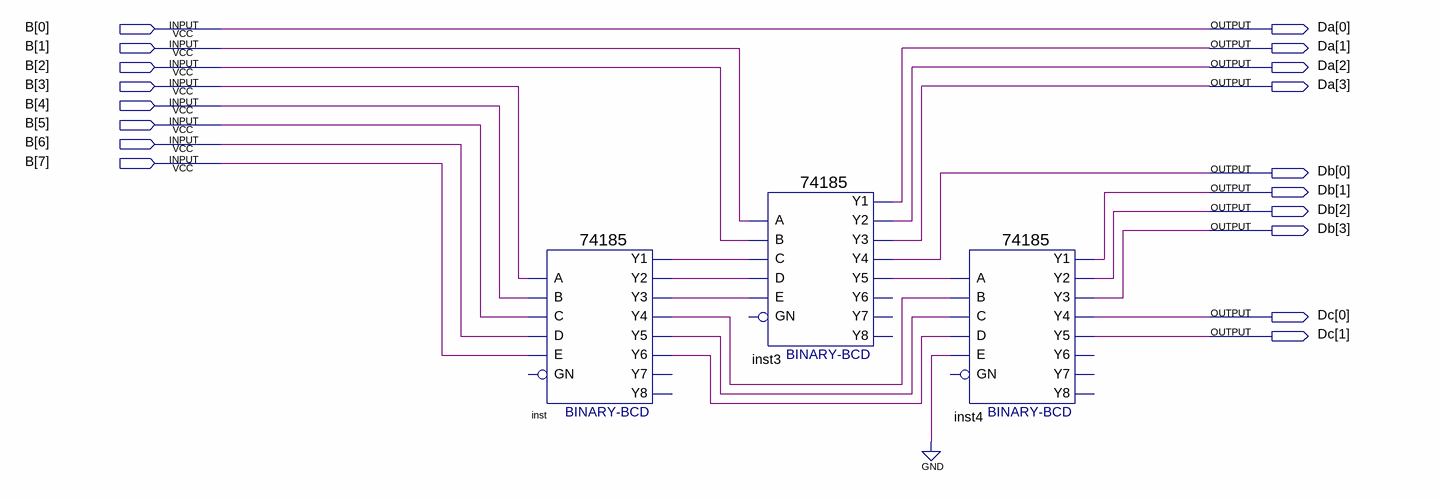
[diagram p0: schematic sheet]
// Quartus schematic Bin-BCD.bdf as structural Verilog: 3 symbols, 18 pins
module \Bin-BCD  (
  input  [7:0] B,
  output [3:0] Da,
  output [3:0] Db,
  output [1:0] Dc
);

  wire inst3_y5, inst_y1, inst_y2, inst_y3, inst_y4, inst_y5, inst_y6;

  \74185  inst (
    .A(B[3]), .B(B[4]), .D(B[6]), .C(B[5]), .E(B[7]), .Y1(inst_y1), .Y3(inst_y3), .Y2(inst_y2), .Y5(inst_y5),
    .Y4(inst_y4), .Y6(inst_y6));  // open: GN, Y8, Y7
  \74185  inst3 (
    .A(B[1]), .B(B[2]), .D(inst_y2), .C(inst_y1), .E(inst_y3), .Y1(Da[1]), .Y3(Da[3]), .Y2(Da[2]),
    .Y5(inst3_y5), .Y4(Db[0]));  // open: GN, Y6, Y8, Y7
  \74185  inst4 (
    .A(inst3_y5), .B(inst_y4), .D(inst_y6), .C(inst_y5), .E(1'b0), .Y1(Db[1]), .Y3(Db[3]), .Y2(Db[2]),
    .Y5(Dc[1]), .Y4(Dc[0]));  // open: GN, Y6, Y8, Y7

  assign Da[0] = B[0];
endmodule
